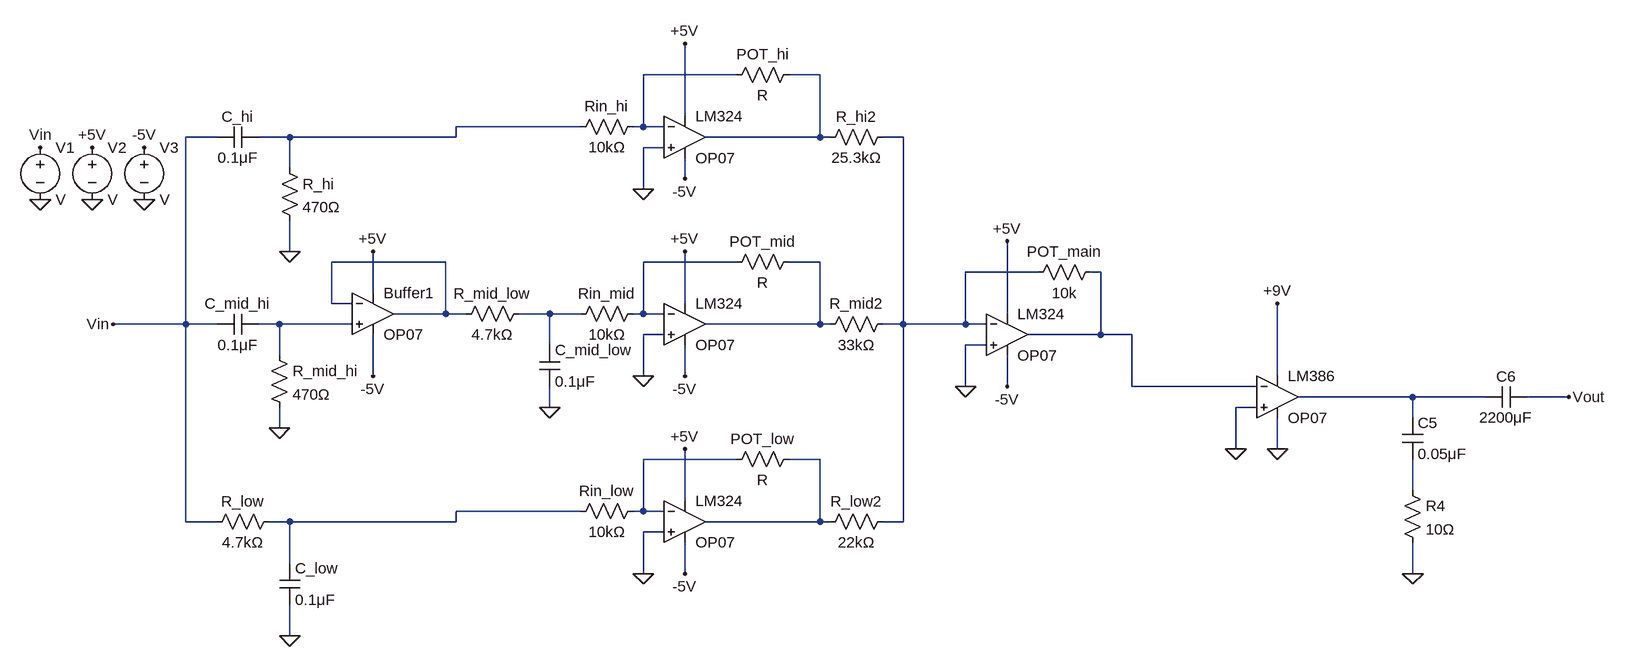
[diagram p0: schematic Audio Equalizer Full Schematic.asc]
Audio Equalizer Full Schematic.asc, the LTspice schematic file:
Version 4.1
SHEET 1 2424 692
WIRE 1072 -240 928 -240
WIRE 1200 -240 1152 -240
WIRE 992 -176 992 -288
WIRE 832 -160 640 -160
WIRE 928 -160 928 -240
WIRE 928 -160 912 -160
WIRE 960 -160 928 -160
WIRE 272 -144 224 -144
WIRE 384 -144 336 -144
WIRE 640 -144 640 -160
WIRE 640 -144 384 -144
WIRE 1200 -144 1200 -240
WIRE 1200 -144 1024 -144
WIRE 1216 -144 1200 -144
WIRE 1328 -144 1296 -144
WIRE 960 -128 928 -128
WIRE 384 -96 384 -144
WIRE 992 -80 992 -112
WIRE 928 -64 928 -128
WIRE 384 32 384 -16
WIRE 624 48 448 48
WIRE 1072 48 928 48
WIRE 1200 48 1152 48
WIRE 1536 64 1424 64
WIRE 1632 64 1616 64
WIRE 512 96 512 32
WIRE 448 112 448 48
WIRE 480 112 448 112
WIRE 992 112 992 32
WIRE 624 128 624 48
WIRE 624 128 544 128
WIRE 656 128 624 128
WIRE 784 128 736 128
WIRE 832 128 784 128
WIRE 928 128 928 48
WIRE 928 128 912 128
WIRE 960 128 928 128
WIRE 1488 128 1488 16
WIRE 224 144 224 -144
WIRE 224 144 112 144
WIRE 272 144 224 144
WIRE 368 144 336 144
WIRE 480 144 368 144
WIRE 1200 144 1200 48
WIRE 1200 144 1024 144
WIRE 1216 144 1200 144
WIRE 1328 144 1328 -144
WIRE 1328 144 1296 144
WIRE 1424 144 1424 64
WIRE 1424 144 1328 144
WIRE 1456 144 1424 144
WIRE 960 160 928 160
WIRE 1632 160 1632 64
WIRE 1632 160 1520 160
WIRE 1680 160 1632 160
WIRE 784 176 784 128
WIRE 1456 176 1424 176
WIRE 368 192 368 144
WIRE 512 224 512 160
WIRE 928 224 928 160
WIRE 992 224 992 176
WIRE 1904 224 1904 112
WIRE 1424 240 1424 176
WIRE 1488 240 1488 192
WIRE 1680 240 1680 160
WIRE 1872 240 1680 240
WIRE 2112 256 1936 256
WIRE 2224 256 2112 256
WIRE 2352 256 2288 256
WIRE 784 272 784 240
WIRE 1872 272 1840 272
WIRE 2112 288 2112 256
WIRE 368 304 368 272
WIRE 1840 336 1840 272
WIRE 1904 336 1904 288
WIRE 1072 352 928 352
WIRE 1200 352 1152 352
WIRE 2112 400 2112 352
WIRE 992 416 992 336
WIRE 832 432 640 432
WIRE 928 432 928 352
WIRE 928 432 912 432
WIRE 960 432 928 432
WIRE 224 448 224 144
WIRE 272 448 224 448
WIRE 384 448 352 448
WIRE 640 448 640 432
WIRE 640 448 384 448
WIRE 1200 448 1200 352
WIRE 1200 448 1024 448
WIRE 1216 448 1200 448
WIRE 1328 448 1328 144
WIRE 1328 448 1296 448
WIRE 960 464 928 464
WIRE 384 512 384 448
WIRE 928 528 928 464
WIRE 992 528 992 480
WIRE 2112 528 2112 480
WIRE 384 624 384 576
FLAG 384 32 0
FLAG 928 -64 0
FLAG 112 144 Vin
FLAG 368 304 0
FLAG 512 32 +5V
FLAG 512 224 -5V
FLAG 784 272 0
FLAG 384 624 0
FLAG 992 -80 -5V
FLAG 992 -288 +5V
FLAG 928 224 0
FLAG 992 224 -5V
FLAG 992 32 +5V
FLAG 928 528 0
FLAG 992 528 -5V
FLAG 992 336 +5V
FLAG 1424 240 0
FLAG 1488 240 -5V
FLAG 1488 16 +5V
FLAG 1840 336 0
FLAG 1904 112 +9V
FLAG 1904 336 0
FLAG 2112 528 0
FLAG 2352 256 Vout
FLAG 0 -48 0
FLAG 80 -48 0
FLAG 160 -48 0
FLAG 0 -128 Vin
FLAG 160 -128 -5V
FLAG 80 -128 +5V
SYMBOL res 368 -112 R0
SYMATTR InstName R_hi
SYMATTR Value 470Ω
SYMBOL cap 336 -160 R90
WINDOW 0 0 32 VBottom 2
WINDOW 3 32 32 VTop 2
SYMATTR InstName C_hi
SYMATTR Value 0.1μF
SYMBOL res 928 -176 R90
WINDOW 0 0 56 VBottom 2
WINDOW 3 32 56 VTop 2
SYMATTR InstName Rin_hi
SYMATTR Value 10kΩ
SYMBOL OpAmps\\OP07 992 -208 R0
SYMATTR InstName LM324
SYMBOL res 1168 -256 R90
WINDOW 0 0 56 VBottom 2
WINDOW 3 32 56 VTop 2
SYMATTR InstName POT_hi
SYMBOL cap 336 128 R90
WINDOW 0 0 32 VBottom 2
WINDOW 3 32 32 VTop 2
SYMATTR InstName C_mid_hi
SYMATTR Value 0.1μF
SYMBOL res 352 176 R0
SYMATTR InstName R_mid_hi
SYMATTR Value 470Ω
SYMBOL OpAmps\\OP07 512 64 R0
SYMATTR InstName Buffer1
SYMBOL res 752 112 R90
WINDOW 0 0 56 VBottom 2
WINDOW 3 32 56 VTop 2
SYMATTR InstName R_mid_low
SYMATTR Value 4.7kΩ
SYMBOL cap 768 176 R0
SYMATTR InstName C_mid_low
SYMATTR Value 0.1μF
SYMBOL res 368 432 R90
WINDOW 0 0 56 VBottom 2
WINDOW 3 32 56 VTop 2
SYMATTR InstName R_low
SYMATTR Value 4.7kΩ
SYMBOL cap 368 512 R0
SYMATTR InstName C_low
SYMATTR Value 0.1μF
SYMBOL res 928 112 R90
WINDOW 0 0 56 VBottom 2
WINDOW 3 32 56 VTop 2
SYMATTR InstName Rin_mid
SYMATTR Value 10kΩ
SYMBOL OpAmps\\OP07 992 80 R0
SYMATTR InstName LM324
SYMBOL res 1168 32 R90
WINDOW 0 0 56 VBottom 2
WINDOW 3 32 56 VTop 2
SYMATTR InstName POT_mid
SYMBOL res 928 416 R90
WINDOW 0 0 56 VBottom 2
WINDOW 3 32 56 VTop 2
SYMATTR InstName Rin_low
SYMATTR Value 10kΩ
SYMBOL OpAmps\\OP07 992 384 R0
SYMATTR InstName LM324
SYMBOL res 1168 336 R90
WINDOW 0 0 56 VBottom 2
WINDOW 3 32 56 VTop 2
SYMATTR InstName POT_low
SYMBOL OpAmps\\OP07 1488 96 R0
SYMATTR InstName LM324
SYMBOL res 1632 48 R90
WINDOW 0 0 56 VBottom 2
WINDOW 3 32 56 VTop 2
SYMATTR InstName POT_main
SYMATTR Value 10k
SYMBOL OpAmps\\OP07 1904 192 R0
SYMATTR InstName LM386
SYMBOL cap 2096 288 R0
SYMATTR InstName C5
SYMATTR Value 0.05μF
SYMBOL res 2096 384 R0
SYMATTR InstName R4
SYMATTR Value 10Ω
SYMBOL cap 2288 240 R90
WINDOW 0 0 32 VBottom 2
WINDOW 3 32 32 VTop 2
SYMATTR InstName C6
SYMATTR Value 2200μF
SYMBOL voltage 0 -144 R0
SYMATTR InstName V1
SYMBOL voltage 80 -144 R0
SYMATTR InstName V2
SYMBOL voltage 160 -144 R0
SYMATTR InstName V3
SYMBOL res 1312 -160 R90
WINDOW 0 0 56 VBottom 2
WINDOW 3 32 56 VTop 2
SYMATTR InstName R_hi2
SYMATTR Value 25.3kΩ
SYMBOL res 1312 128 R90
WINDOW 0 0 56 VBottom 2
WINDOW 3 32 56 VTop 2
SYMATTR InstName R_mid2
SYMATTR Value 33kΩ
SYMBOL res 1312 432 R90
WINDOW 0 0 56 VBottom 2
WINDOW 3 32 56 VTop 2
SYMATTR InstName R_low2
SYMATTR Value 22kΩ

The netlist it stands for:
* Audio Equalizer Full Schematic.asc
R_hi N003 0 470Ω
C_hi N003 Vin 0.1μF
Rin_hi N001 N003 10kΩ
X§LM324 0 N001 +5V -5V N002 LT1001  ; OP07, pins In+ In- V+ V- OUT
R§POT_hi N002 N001 R
C_mid_hi N010 Vin 0.1μF
R_mid_hi N010 0 470Ω
X§Buffer1 N010 N005 +5V -5V N005 LT1001  ; OP07, pins In+ In- V+ V- OUT
R_mid_low N009 N005 4.7kΩ
C_mid_low N009 0 0.1μF
R_low N015 Vin 4.7kΩ
C_low N015 0 0.1μF
Rin_mid N006 N009 10kΩ
X§LM324 0 N006 +5V -5V N007 LT1001  ; OP07, pins In+ In- V+ V- OUT
R§POT_mid N007 N006 R
Rin_low N012 N015 10kΩ
X§LM324 0 N012 +5V -5V N013 LT1001  ; OP07, pins In+ In- V+ V- OUT
R§POT_low N013 N012 R
X§LM324 0 N004 +5V -5V N008 LT1001  ; OP07, pins In+ In- V+ V- OUT
R§POT_main N008 N004 10k
X§LM386 0 N008 +9V 0 N011 LT1001  ; OP07, pins In+ In- V+ V- OUT
C5 N011 N014 0.05μF
R4 N014 0 10Ω
C6 Vout N011 2200μF
V1 Vin 0 V
V2 +5V 0 V
V3 -5V 0 V
R_hi2 N004 N002 25.3kΩ
R_mid2 N004 N007 33kΩ
R_low2 N004 N013 22kΩ
.lib LTC.lib
.backanno
.end